# EAGLE design rgb-nir-uv-stalk (EAGLE 6.5.0)
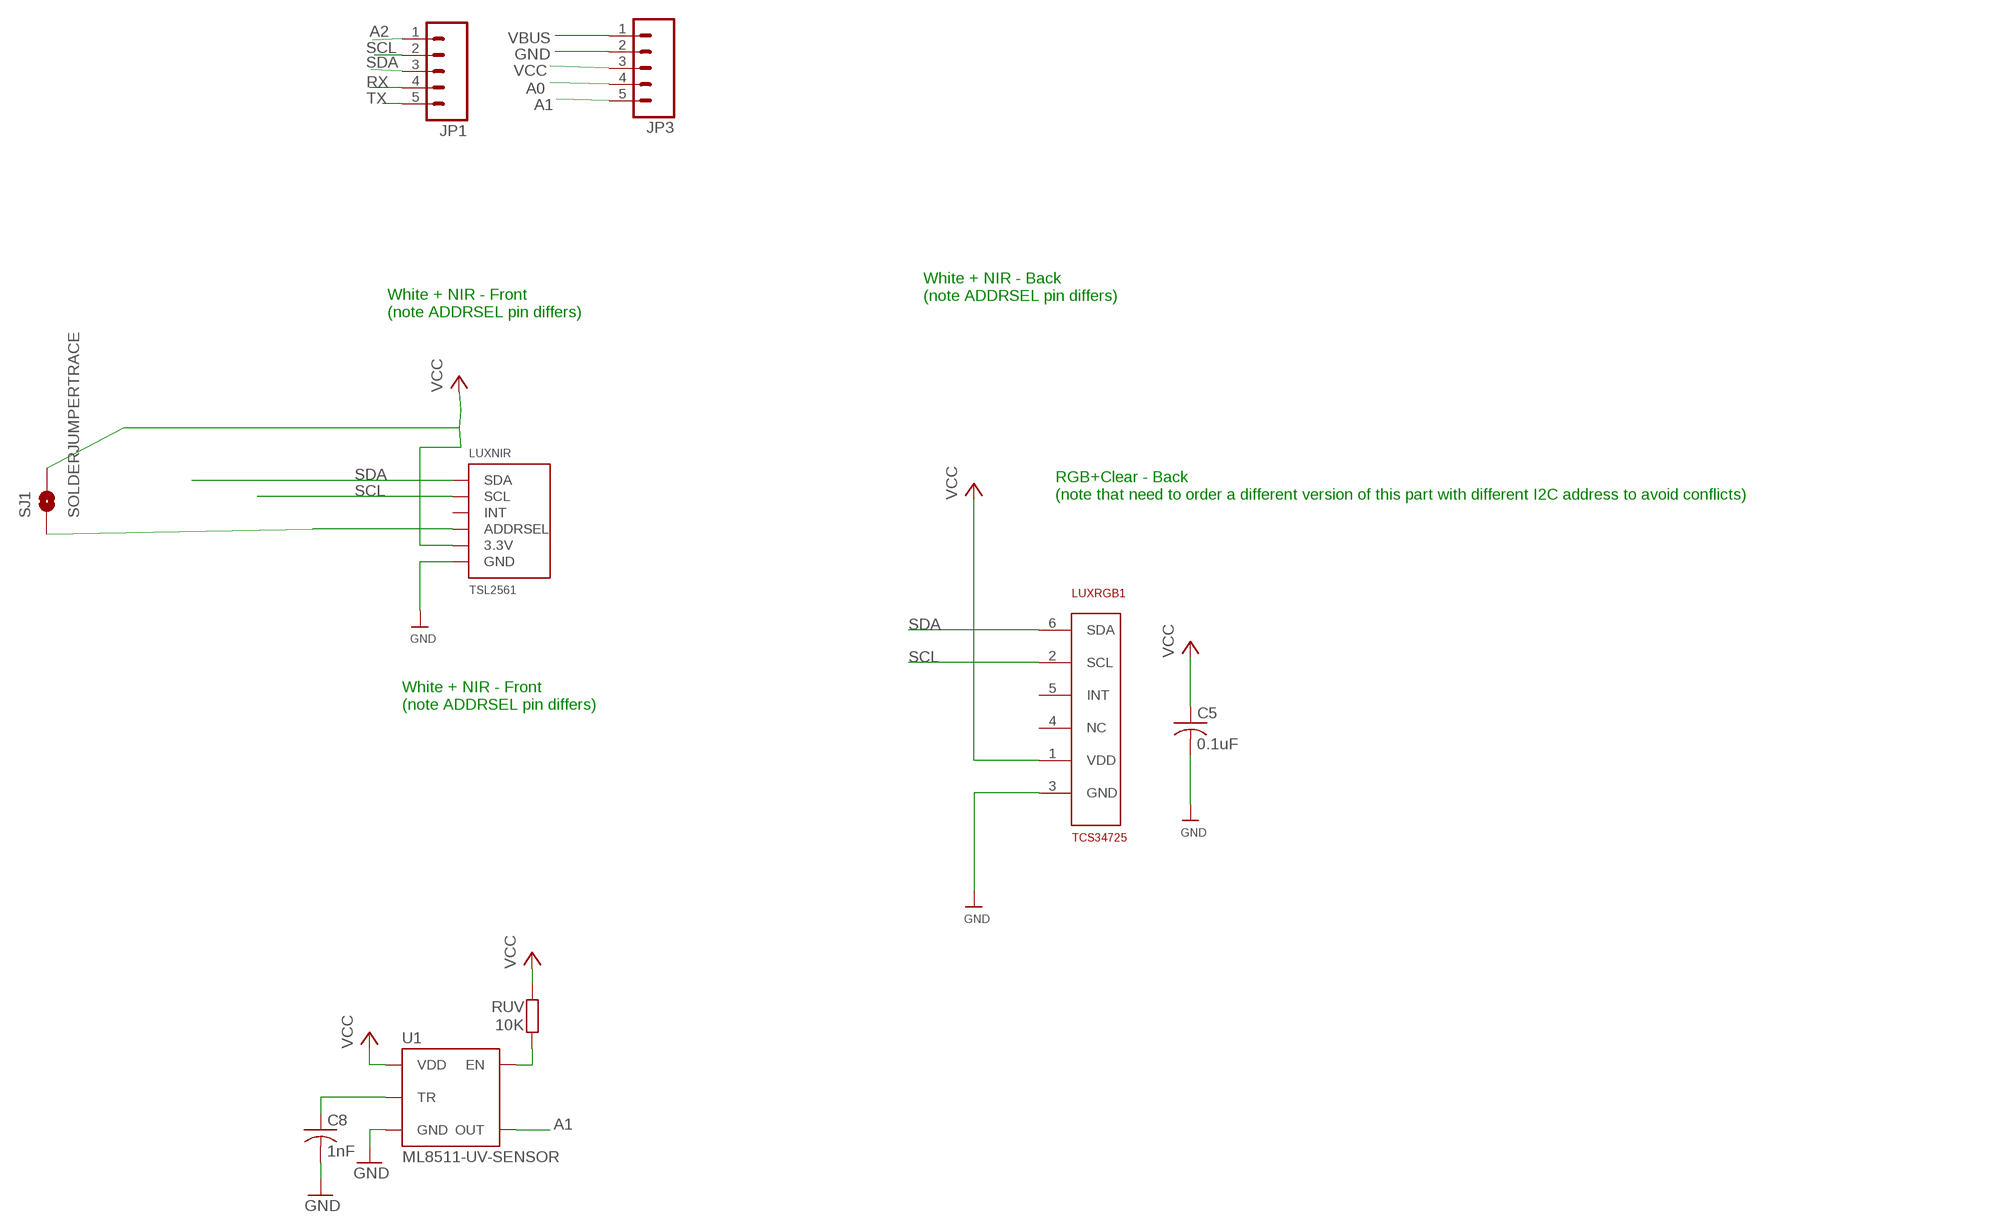
[diagram p0: schematic, sheet 1]

## Parts
C5  0.1uF  C-USC0805  [C0805]
C8  1nF  C-USC0805  [C0805]
JP1  M05LOCK  [1X05_LOCK]
JP3  M05LOCK  [1X05_LOCK]
LUXNIR  TSL2561  [TSL2561_FN@1]
LUXRGB1  TCS34725  [DFN-6]
RUV  10K  R-EU_R0805  [R0805]
SJ1  SOLDERJUMPERTRACE  [SJ_2S-TRACE]
U1  ML8511-UV-SENSOR  ML8511-UV-SENSORSMD  [ML8511]

## Nets
A0: JP3.4
A1: JP3.5 U1.8(OUT)
A2: JP1.1
ENABLE: RUV.1 U1.4(EN)
GND: C5.2 C8.2 JP3.2 LUXNIR.VSS(GND) LUXRGB1.3(GND) U1.5(GND)
N$1: LUXNIR.ADR(ADDRSEL) SJ1.1
N$8: C8.1 U1.10(TR)
RX: JP1.4
SCL: JP1.2 LUXNIR.CLK(SCL) LUXRGB1.2(SCL)
SDA: JP1.3 LUXNIR.DATA(SDA) LUXRGB1.6(SDA)
TX: JP1.5
VBUS: JP3.1
VCC: C5.1 JP3.3 LUXNIR.VDD(3.3V) LUXRGB1.1(VDD) RUV.2 SJ1.2 U1.7(VDD)
Unconnected: LUXNIR.INT LUXRGB1.4(NC) LUXRGB1.5(INT)

## Notes on the sheet
- White + NIR - Back
  (note ADDRSEL pin differs)
- White + NIR - Front
  (note ADDRSEL pin differs)
- RGB+Clear - Back 
  (note that need to order a different version of this part with different I2C address to avoid conflicts)
- White + NIR - Front
  (note ADDRSEL pin differs)

## Library data of the parts
C5 C8 = adafruit:C-US: CAPACITOR, American symbol
JP1 JP3 = SparkFun-Connectors:M05: Header 5 Standard 5-pin 0.1" header. Use with straight break away headers (SKU : PRT-00116), right angle break away headers (PRT-00553), swiss pins (PRT-00743), machine pins (PRT-00117), and female headers (PRT-00115). Molex polarized connector foot print use with SKU : PRT-08230 with associated crimp pins and housings.
LUXNIR = microbuilder:TSL2561: TSL2561 Light-To-Digital Sensor Mouser Part Numbers: CS (obsolete): 856-TSL2561CS DFN (cheapest): 856-TSL2561FN
LUXRGB1 = dwbLibrary:TCS34725
RUV = rcl:R-EU_: RESISTOR, European symbol
SJ1 = SparkFun-Passives:SOLDERJUMPER: Solder Jumper Standard SMD solder jumper. Used to automate production. Two varients : Normally Open and Normally Closed are the same, but have different paste layers. NC will have a large amount of paste and should jumper during reflow.
U1 = ML8511:ML8511-UV-SENSOR

## Board
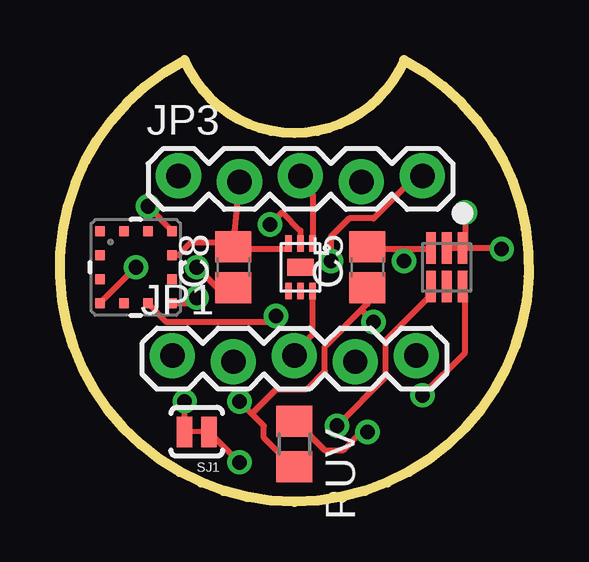
[diagram p1: board, top side]
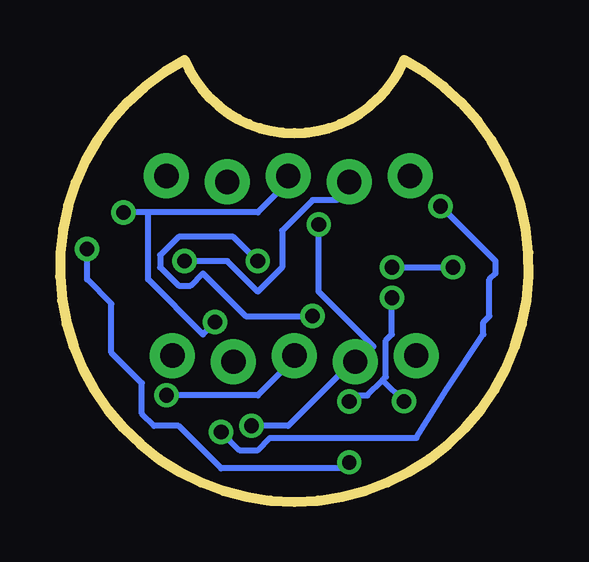
[diagram p2: board, bottom side, seen from below]

Size 19.53 x 18.41 mm. Coordinates in mm from the lower left corner, seen from the top.
Outline: 14.34,18.41 arc-135 5.19,18.41 arc304 14.34,18.41
Copper layers (1*16): Top 0.035mm / dielectric 1.5mm / Bottom 0.035mm
Design rules "default": minimum track width 10mil, minimum drill 24mil, track to track 8mil, track to pad 8mil, pad to pad 8mil, via to via 8mil, smd to smd 8mil, copper to edge 40mil, drill to drill 8mil, minimum pad ring 10mil, minimum via ring 8mil, stop-mask expansion 4mil, vias tented up to drill 0mil, thermal gap 10mil

### Footprints (pad centres in the part's own frame; a part is rotated, then mirrored left to right if it is on the bottom)
C0805 = smd 1.3 x 1.5: 1 -0.85,0; 2 0.85,0
1X05_LOCK = drill 1.016 pad 1.88: 1 0,0.127; 2 2.54,-0.127; 3 5.08,0.127; 4 7.62,-0.127; 5 10.16,0.127
TSL2561_FN@1 = smd 1.3 x 0.4: ADR -0.8,0; CLK 0.8,-0.65; DATA 0.8,0.65; INT 0.8,0; VDD -0.8,0.65; VSS -0.8,-0.65
DFN-6 = smd 0.28 x 0.7: 1 -0.5,-0.988; 2 0,-0.988; 3 0.5,-0.988; 4 0.5,0.988; 5 0,0.988; 6 -0.5,0.988 | smd 1.1 x 0.7: P$1 0,0
R0805 = smd 1.3 x 1.5: 1 -0.95,0; 2 0.95,0
SJ_2S-TRACE = smd 0.635 x 1.27: 1 -0.508,0; 2 0.508,0
ML8511 = smd 0.4 x 0.4: 1 -1.5,-1.5; 2 -1.5,-0.5; 3 -1.5,0.5; 4 -1.5,1.5; 5 -0.5,1.5; 6 0.5,1.5; 7 1.5,1.5; 8 1.5,0.5; 9 1.5,-0.5; 10 1.5,-1.5; 11 0.5,-1.5; 12 -0.5,-1.5

### Placement (x,y rotation side)
C5  12.81,9.77 90 top
C8  7.22,9.77 90 top
JP1  4.68,5.96 0 top
JP3  4.94,13.45 0 top
LUXNIR  16.11,9.77 270 top
LUXRGB1  10.02,9.77 180 top
RUV  9.76,2.41 270 top
SJ1  5.7,2.91 180 top
U1  3.16,9.77 270 top

### Tracks (layer width: path | path; a pad name or v marks a point on that pad's centre or on a via)
A1  (via drill 0.61)
  Top 0.254: v9,7.74 8.75,7.49 4.43,7.49 3.67,8.25 U1.8 | v11.29,10.03 11.29,11.04 12.05,11.8 13.07,11.8 14.84,13.58 JP3.5
  Bottom 0.254: v9,7.74 11.8,7.74 13.57,9.52 14.08,9.01 14.59,9.01 15.35,9.77 15.35,10.28 14.59,11.04 12.3,11.04 v11.29,10.03
ENABLE  (via drill 0.61)
  Top 0.254: v3.67,12.31 4.68,11.3 U1.4 | v12.81,2.91 12.56,2.91 11.8,2.15 11.03,2.15 9.76,3.42 RUV.1
  Bottom 0.254: v3.67,12.31 1.38,10.03 1.38,9.52 1.64,9.26 1.64,7.74 1.89,7.49 1.89,6.98 3.41,4.69 4.68,2.66 10.78,2.66 11.29,2.15 12.05,2.15 v12.81,2.91
GND  (via drill 0.61)
  Top 0.254: 7.22,10.79 5.45,10.79 4.94,10.28 4.68,10.28 U1.5 | LUXRGB1.3 9.51,10.53 7.22,10.53 C8.2 7.22,10.79 | 14.34,10.53 12.81,10.53 C5.2 | 14.34,10.53 15.35,10.53 LUXNIR.VSS | v14.34,10.03 14.34,10.53 | JP3.2 7.22,10.79
  Bottom 0.254: v14.34,10.03 12.56,10.03 11.29,8.76 10.27,9.77 10.27,11.3 9,12.57 7.99,12.57 7.22,13.33 JP3.2
N$1  (via drill 0.6)
  Top 0.254: SJ1.1 v7.48,1.64 | v18.4,10.53 18.36,10.57 LUXNIR.ADR
  Bottom 0.254: v7.48,1.64 7.73,1.39 12.81,1.39 14.59,3.17 15.61,3.17 16.11,3.68 16.11,4.95 17.38,6.22 17.38,8.25 18.4,9.26 v18.4,10.53
N$8  (via drill 0.61)
  Top 0.254: v3.16,9.77 U1.10 1.64,8.25 | v5.7,9.77 6.97,8.5 7.22,8.76 C8.1
  Bottom 0.254: v5.7,9.77 v3.16,9.77
SCL  (via drill 0.61)
  Top 0.254: LUXRGB1.2 10.02,11.3 9.26,12.06 v8.75,11.55 | v11.54,3.17 13.57,5.2 13.57,6.72 15.35,8.5 15.35,8.76 LUXNIR.CLK
  Bottom 0.254: v8.75,11.55 8.75,8.76 6.46,6.47 7.22,5.71 JP1.2 7.22,5.96 10.02,3.17 v11.54,3.17
SDA  (via drill 0.61)
  Top 0.254: LUXRGB1.6 10.53,8.76 10.53,6.98 9.76,6.22 JP1.3 | v15.1,4.44 16.88,6.22 16.88,8.76 LUXNIR.DATA
  Bottom 0.254: v15.1,4.44 11.29,4.44 9.76,5.96 JP1.3
VCC  (via drill 0.6, 0.61)
  Top 0.254: LUXRGB1.1 10.53,10.79 10.53,12.82 9.76,13.58 JP3.3 | v16.88,12.06 16.88,10.79 LUXNIR.VDD | v5.7,8.5 5.45,8.25 4.68,8.25 U1.7 | 7.99,3.68 8.49,3.17 8.49,2.66 9.76,1.39 RUV.2 | 7.99,3.68 v7.48,4.18 | C5.1 12.81,8.25 12.56,7.99 | 12.56,7.99 11.03,6.47 11.03,5.45 10.27,4.69 9,4.69 7.99,3.68 | 12.56,7.99 v13.07,7.49 | SJ1.2 v5.19,4.18
  Bottom 0.254: 15.86,12.06 11.29,12.06 9.76,13.58 JP3.3 | 15.86,12.06 v16.88,12.06 | v5.7,8.5 5.7,6.98 5.95,6.72 5.95,5.2 6.08,5.07 | 6.08,5.07 6.72,4.44 7.22,4.44 v7.48,4.18 | 15.86,12.06 15.86,9.26 13.57,6.98 v13.07,7.49 | v5.19,4.18 6.08,5.07